# Altium schematic sheet Main.SchDoc
size A; SheetNumber: 1; SheetTotal: 1
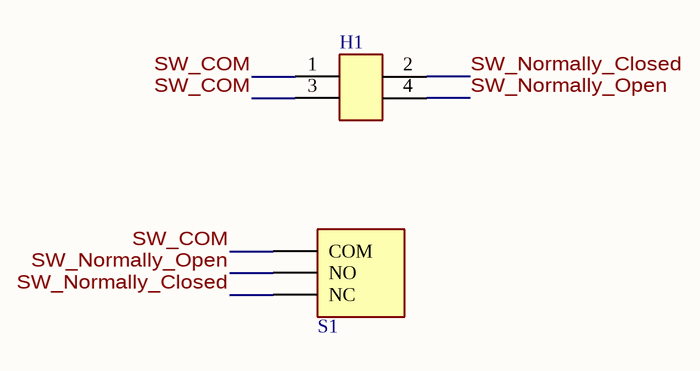
[diagram p0: Main.SchDoc]

## Parts
H1  [Header] 2x2 90deg Male  [[Header] 2x2 90deg Male]  (value not drawn)
S1  [SPDT] Limit Switch w/ Roller  [[SPDT] Limit Switch w/ Roller]  (value not drawn)

## Nets
SW_COM: H1.1 H1.3 S1.1(COM)
SW_Normally_Closed: H1.2 S1.3(NC)
SW_Normally_Open: H1.4 S1.2(NO)

## Library data of the parts
H1 = [Header] 2x2 90deg Male: PH2RA-04-UA; Supplier 1: DigiKey; Supplier Part Number 1: 2057-PH2RA-04-UA-ND
S1 = [SPDT] Limit Switch w/ Roller: ComponentLink1Description: AliExpress Supplier; ComponentLink1URL: https://a.aliexpress.com/_mqu0KvN